# EAGLE design Schematics (EAGLE 9.6.2)
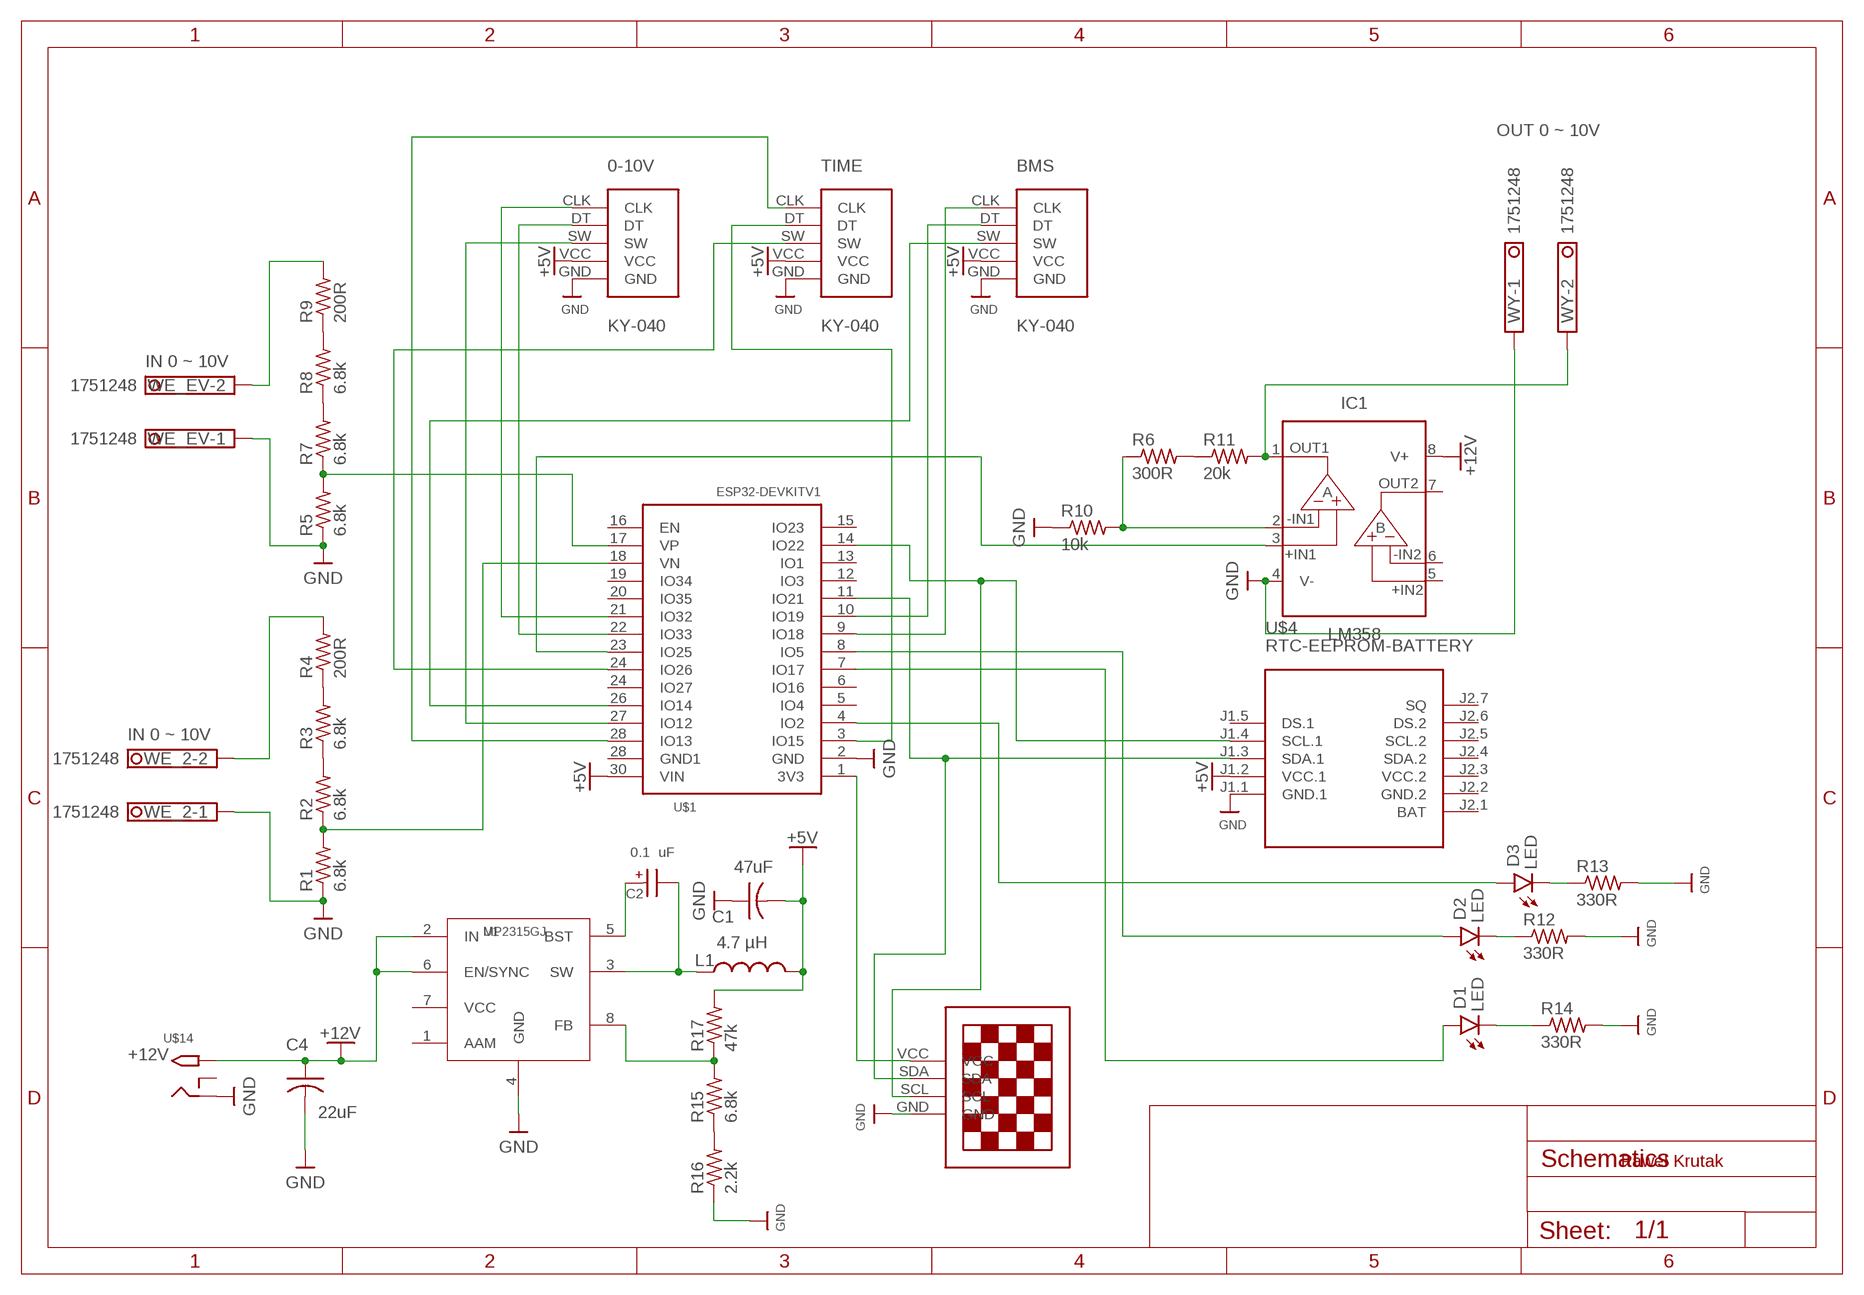
[diagram p0: schematic, sheet 1]

## Parts
0-10V  KY-040  [KY-040-PORT]
BMS  KY-040  [KY-040-PORT]
C1  47uF  ECA-1HM220  [CAP_RADIAL_2MM]
C2  0.1 uF  WCAP-ATG5_5X11_860020772001  [WCAP-ATG5_5X11(DXL)]
C4  22uF  ECA-1HM220  [CAP_RADIAL_2MM]
D1  LED  LEDWHITE90  [LEDRD254W60D565H860B_W90]
D2  LED  LEDWHITE90  [LEDRD254W60D565H860B_W90]
D3  LED  LEDWHITE90  [LEDRD254W60D565H860B_W90]
IC1  LM358  LM358_DIP  [DIP826W53P254L959H508Q8B]
L1  4.7 µH  INDUCTORSRN6045  [SRN6045]
R1  6.8k  R-US_M0805  [M0805]
R2  6.8k  R-US_M0805  [M0805]
R3  6.8k  R-US_M0805  [M0805]
R4  200R  R-US_M0805  [M0805]
R5  6.8k  R-US_M0805  [M0805]
R6  300R  R-US_M0805  [M0805]
R7  6.8k  R-US_M0805  [M0805]
R8  6.8k  R-US_M0805  [M0805]
R9  200R  R-US_M0805  [M0805]
R10  10k  R-US_M0805  [M0805]
R11  20k  R-US_M0805  [M0805]
R12  330R  R-US_M0805  [M0805]
R13  330R  R-US_M0805  [M0805]
R14  330R  R-US_M0805  [M0805]
R15  6.8k  R-US_M0805  [M0805]
R16  2.2k  R-US_M0805  [M0805]
R17  47k  R-US_M0805  [M0805]
TIME  KY-040  [KY-040-PORT]
U1  MP2315GJ  [SOT-23-8]
U$1  ESP32DEVKITV1  [ESP32-DEVKITV1]
U$4  RTC-EEPROM-BATTERY  [RTC_EEPROM_BATTERY]
U$8  13"OLED13"OLED  [1.3"OLED]
U$14  2.1MMJACKTHM  [PJ-102A]
WE_2  1751248  [1751248]
WE_EV  1751248  [1751248]
WY  1751248  [1751248]

## Nets
+5V: 0-10V.VCC BMS.VCC C1.2 L1.2 R17.2 TIME.VCC U$1.30(VIN) U$4.J1.2(VCC.1)
+12V: C4.1 IC1.8(V+) U1.2(IN) U1.6(EN/SYNC) U$14.TIP
GND: 0-10V.GND BMS.GND C1.1 C4.2 IC1.4(V-) R1.1 R5.1 R10.1 R12.2 R13.2 R14.2 R16.1 TIME.GND U1.4(GND) U$1.2(GND) U$4.J1.1(GND.1) U$8.GND U$14.RING WE_2.1 WE_EV.1 WY.1
N$1: IC1.1(OUT1) R11.2 WY.2
N$2: R6.2 R11.1
N$3: IC1.2(-IN1) R6.1 R10.2
N$4: IC1.3(+IN1) U$1.23(IO25)
N$6: R2.2 R3.1
N$7: R5.2 R7.1 U$1.17(VP)
N$8: R4.2 WE_2.2
N$9: R3.2 R4.1
N$10: R7.2 R8.1
N$11: R1.2 R2.1 U$1.18(VN)
N$12: R8.2 R9.1
N$13: U$1.1(3V3) U$8.VCC
N$14: U$1.14(IO22) U$4.J1.4(SCL.1) U$8.SCL
N$15: U$1.11(IO21) U$4.J1.3(SDA.1) U$8.SDA
N$16: 0-10V.CLK U$1.21(IO32)
N$17: BMS.CLK U$1.9(IO18)
N$18: BMS.DT U$1.10(IO19)
N$19: 0-10V.DT U$1.22(IO33)
N$20: BMS.SW U$1.26(IO14)
N$21: 0-10V.SW U$1.27(IO12)
N$22: D2.1(A) U$1.8(IO5)
N$23: R15.1 R16.2
N$24: D1.1(A) U$1.7(IO17)
N$25: R9.2 WE_EV.2
N$27: D3.2(C) R13.1
N$28: D2.2(C) R12.1
N$29: D3.1(A) U$1.4(IO2)
N$30: D1.2(C) R14.1
N$31: TIME.CLK U$1.28(IO13)
N$32: TIME.DT U$1.3(IO15)
N$33: TIME.SW U$1.24(IO26)
N$34: C2.1(+) U1.5(BST)
N$36: R15.2 R17.1 U1.8(FB)
N$37: C2.2(-) L1.1 U1.3(SW)
Unconnected: IC1.5(+IN2) IC1.6(-IN2) IC1.7(OUT2) U1.1(AAM) U1.7(VCC) U$1.5(IO4) U$1.6(IO16) U$1.12(IO3) U$1.13(IO1) U$1.15(IO23) U$1.16(EN) U$1.19(IO34) U$1.20(IO35) U$1.24(IO27) U$1.28(GND1) U$4.J1.5(DS.1) U$4.J2.1(BAT) U$4.J2.4(SDA.2) U$4.J2.5(SCL.2) U$4.J2.6(DS.2) U$4.J2.7(SQ) U$14.RING_SW

## Notes on the sheet
- OUT 0 ~ 10V
- IN 0 ~ 10V
- IN 0 ~ 10V
- +12V
- Paweł Krutak

## Power pins joined to a net without a drawn wire
GND.2: U$4.J2.2(GND.2)
VCC.2: U$4.J2.3(VCC.2)

## Library data of the parts
0-10V BMS TIME = KY-040:KY-040: Check availability <https://pricing.snapeda.com/parts/KY-040/Joy-IT/view-part?ref=eda>; AVAILABILITY: Not in stock; CHECK_PRICES: https://www.snapeda.com/parts/KY-040/Joy-IT/view-part/?ref=eda; DESCRIPTION: KY-5.0-4P Green(RAL6018/T) ; CONTACT WITH TIN PLATED MARK; MF: Joy-IT; MP: KY-040; PACKAGE: Package; PRICE: None; SNAPEDA_LINK: https://www.snapeda.com/parts/KY-040/Joy-IT/view-part/?ref=snap
C1 C4 = Resistor_Capacitor:ECA-1HM220: CAP ALUM 22UF 20% 50V RADIAL Manufacturer's datasheet <https://media.digikey.com/pdf/Data%20Sheets/Panasonic%20Electronic%20Components/ECA-xxM%20Series,TypeA.pdf>; CREATED_BY: PCBLayout.com; DIGIKEY_PART_NUMBER: P5179-ND; MANUFACTURER: Panasonic Electronic Components; MPN: ECA-1HM220; PACKAGE: CAP RADIAL 2MM LS
C2 = Wurth_Capacitors_WCAP-ATG5:WCAP-ATG5_5X11: WCAP-ATG5 Aluminium Electrolytic Capacitors General Purpose +105 °C Characteristics General purpose product series with max. operating temperature of +105 °C Mounting style: THT Radial Capacitance range: 0.1 µF ‒ 18000 µF Capacitance tolerance: ±20 % Operating temperature: -40 °C up to +105 °C for UR < 400 V(DC) -25 °C up to +105 °C for UR ≥ 400 V(DC) Endurance: 2000 h @ +105 °C Dimensions (DxL) in mm: 5.0 x 11.0 up to 22.0 x 31.0 Recommended soldering: Wave soldering Applications Filtering Smoothing Energy storage Coupling e.g. Switched-mode power supply, AC/DC converter, adapter, charger, digital camera <https://www.we-online.com/catalog/media/o683503v209%20family-wcap-atg5-860020672004.jpg> Details see: www.we-online.com/catalog/WCAP-ATG5 <www.we-online.com/catalog/WCAP-ATG5/?utm_source=eagle_model&utm_medium=description_link&utm_campaign=eisos_eagle> Updated by yingchun,Shan;2020-02-28 2020(C) Würth Elektronik; DATASHEET-URL: https://www.we-online.com/redexpert/spec/860020772001?ae; DF: 9%; DIAMETER: 5mm; I-LEAK: 3uA; I-RIPPLE: 1.3mA; L: 11mm; OPERATING-TEMPERATURE: -40 °C up to +105 °C; PART-NUMBER: 860020772001; PITCH: 2mm; TECHNICAL-REFERENCE: ATDC110R10M063DSPA3B000; VR: 63V(DC)
D1-D3 = LED Flashlight Component Library:LED: Radial LED (Round), 2.54 mm pitch, 5.65 mm body diameter, 8.60 mm body height Radial LED (Round) package with 2.54 mm pitch (lead spacing), 0.60 mm lead width, 0.50 mm lead thickness, 5.65 mm body diameter and 8.60 mm body height
IC1 = IC_Linear:LM358: Dual Operational Amplifier Reference Datasheet <https://www.ti.com/lit/ds/symlink/lm158-n.pdf>; CATEGORY: Amplifier; DESCRIPTION: Dual Operational Amplifier; MANUFACTURER: Generic; MPN: Generic; SERIES: LM358; SUB-CATEGORY: OpAmp; TYPE: Dual
L1 = BeagleBone_Blue_R3:INDUCTOR: Inductors Basic Inductor/Choke - 0603 and 1206. Footprints are not proven and vary greatly between part numbers. SRN6045- 33uH, 20% 1.4A
R1-R17 = adafruit:R-US_: RESISTOR, American symbol
U1 = MP2315GJ:MP2315GJ: MP2315 High Efficiency 3A, 24V, 500kHz Synchronous Step Down Converter; MPN: MP2315
U$1 = ESP32-DEVKITV1:ESP32DEVKITV1; OC_FARNELL: unknown
U$4 = diy-modules:RTC-EEPROM-BATTERY: RTC Module with Battery and EEPROM based on DS1307 and AT24C32 chips
U$8 = 13oled:13"OLED
U$14 = adafruit:2.1MMJACK: 2.1mm x 5.5mm THM DC jack with internal switch. Digikey part #PJ-102A, 4UCON part #05537 2.1mm x 5.5mm SMT DC jack with internal switch. Digikey part #PJ-002A-SMT, 4UCON part #03267 By microbuilder.eu & adafruit.com
WE_2 WE_EV WY = con-phoenix-350:1751248: MKDS 1/ 2-3,5 Printklemme Nennstrom: 10 A Bemessungsspannung: 160 V Raster: 3,5 mm Polzahl: 2 Montageart: Löten Anschlussart: Schraubanschluss Anschlussrichtung vom Leiter zur Platine: 0° Source: http://eshop.phoenixcontact.com .. 1751248.pdf; OC_FARNELL: unknown; OC_NEWARK: unknown

## Net classes
0 default: width 0.381 mm, drill 0.351 mm, clearance 0.381 mm

## Board
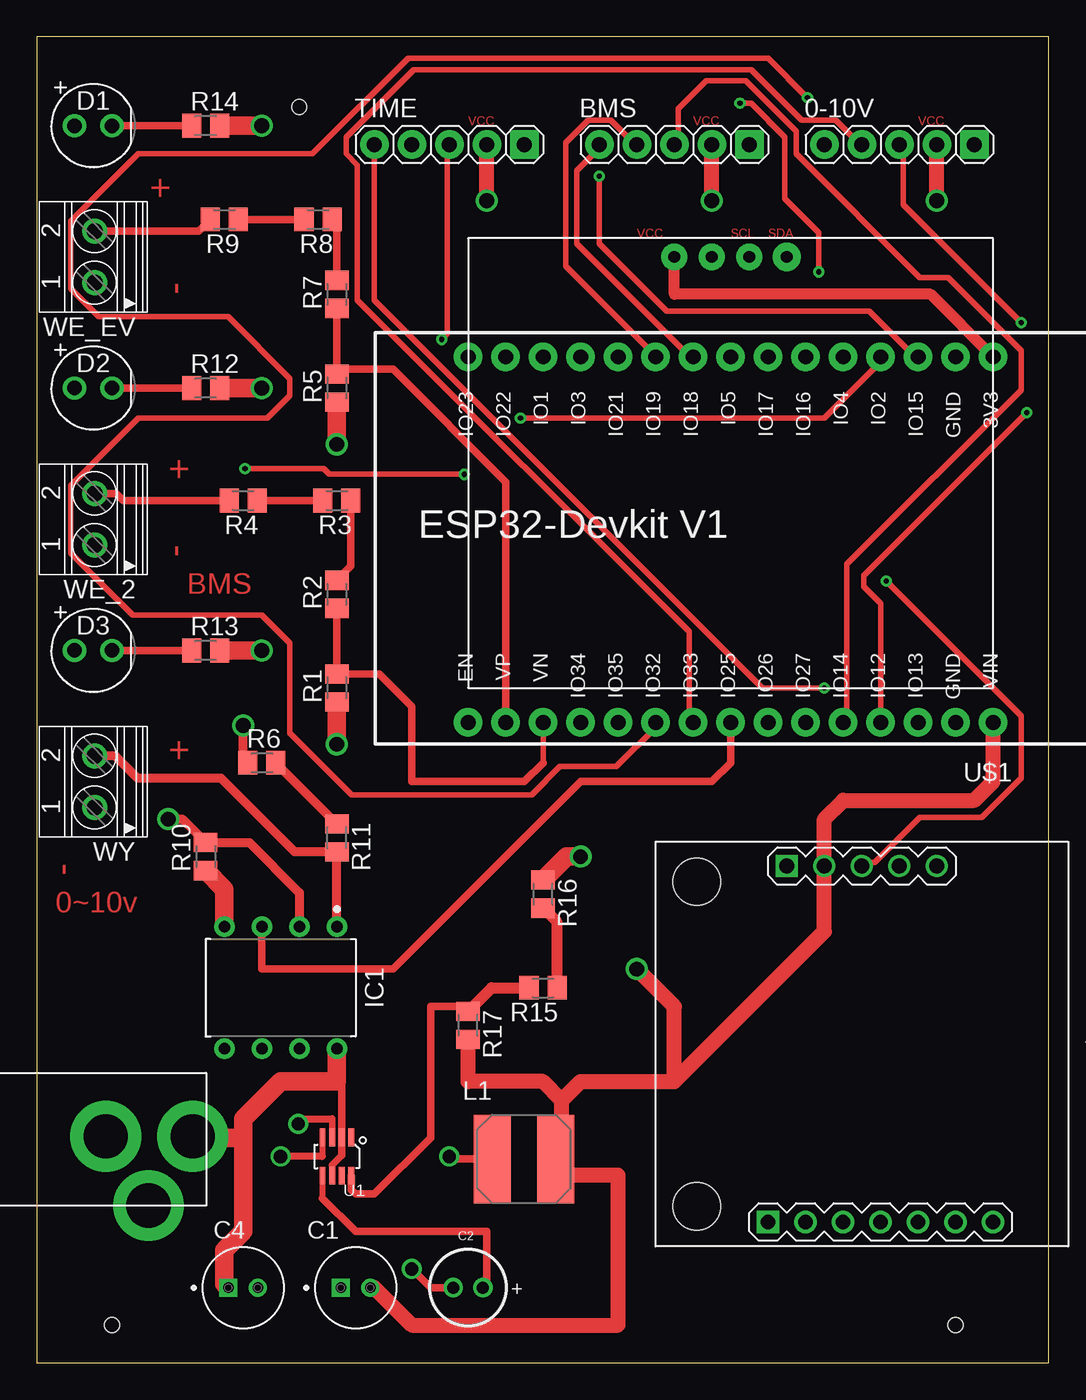
[diagram p1: board, top side]
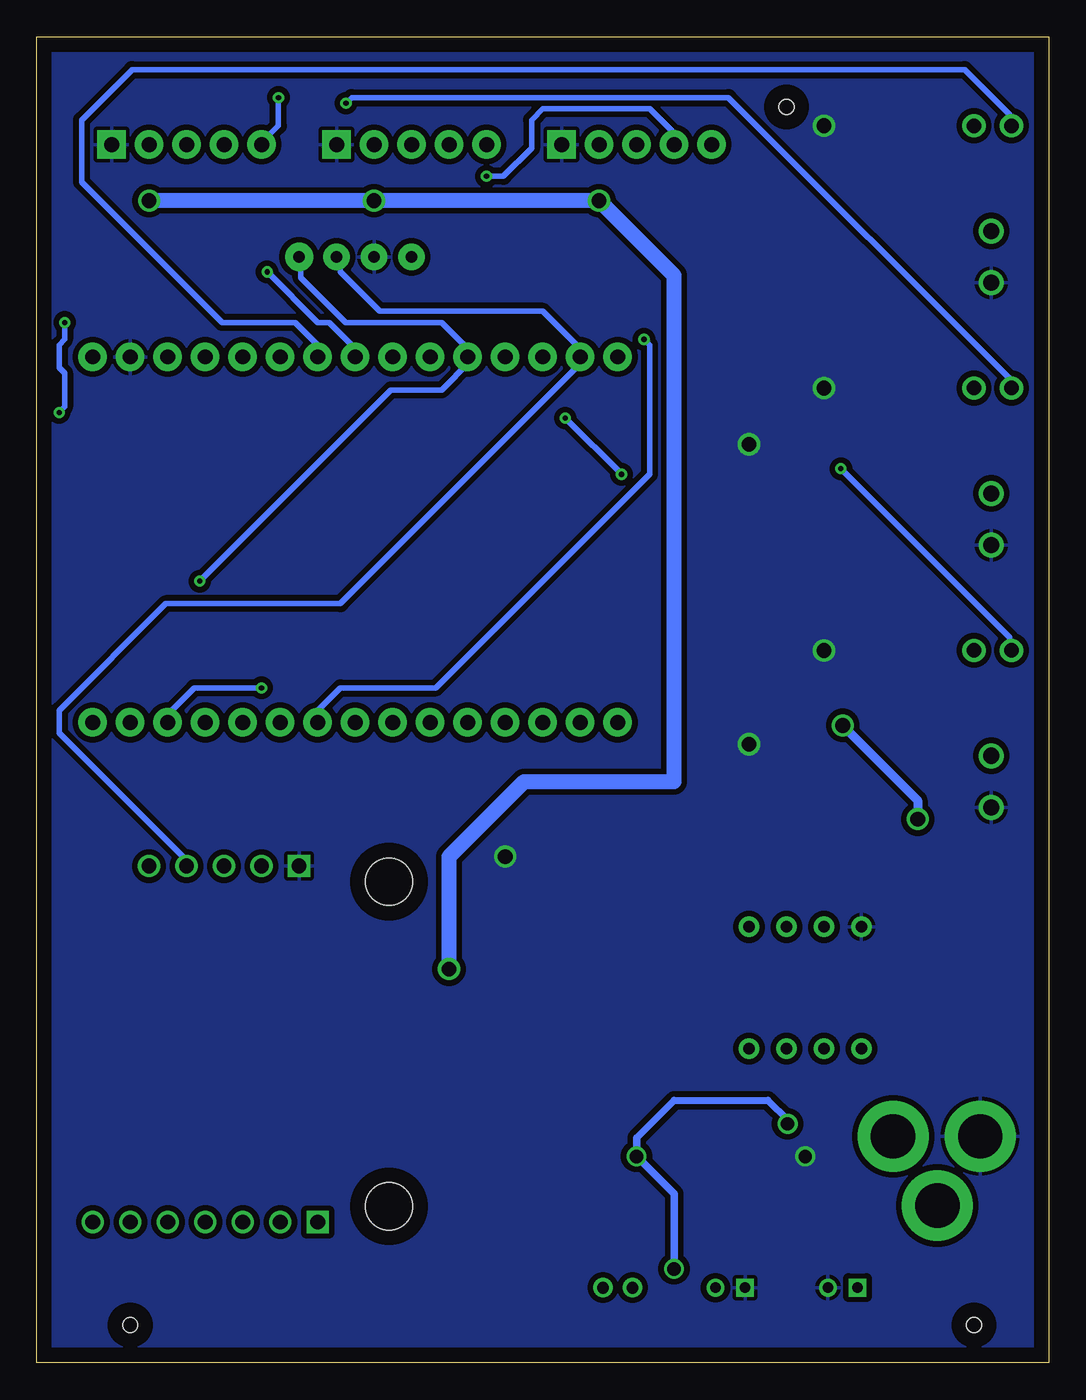
[diagram p2: board, bottom side, seen from below]

Size 68.56 x 89.84 mm. Coordinates in mm from the lower left corner, seen from the top.
Outline: 0,0 68.56,0 68.56,89.84 0,89.84 0,0
Copper layers (1*16): Top 0.035mm / dielectric 1.5mm / Bottom 0.035mm
Design rules "default *": minimum track width 6mil, minimum drill 0.35mm, track to track 15mil, track to pad 10mil, pad to pad 10mil, via to via 30mil, smd to smd 6mil, copper to edge 40mil, drill to drill 6mil, minimum pad ring 10mil, minimum via ring 8mil, stop-mask expansion 4mil, vias tented up to drill 0mil, thermal gap 10mil
Holes 1 mm at 5.08,2.54 62.23,2.54 17.78,85.09

### Footprints (pad centres in the part's own frame; a part is rotated, then mirrored left to right if it is on the bottom)
KY-040-PORT = drill 1.016 pad 1.93: CLK -6.35,0; DT -3.81,0; SW -1.27,0; VCC 1.27,0 | drill 1.016 pad 1.93 square: GND 3.81,0
CAP_RADIAL_2MM = drill 0.7 pad 1.1 square: 1 -1,0 | drill 0.7 pad 1.1: 2 1,0
WCAP-ATG5_5X11(DXL) = drill 0.8: 1 1,0; 2 -1,0
LEDRD254W60D565H860B_W90 = drill 0.981 pad 1.581: 1 -1.27,0; 2 1.27,0
DIP826W53P254L959H508Q8B = drill 0.786 pad 1.386: 1 -4.13,3.81; 2 -4.13,1.27; 3 -4.13,-1.27; 4 -4.13,-3.81; 5 4.13,-3.81; 6 4.13,-1.27; 7 4.13,1.27; 8 4.13,3.81
SRN6045 = smd 2.5 x 6: 1 -2.175,-0.175; 2 2.125,-0.175
M0805 = smd 1.3 x 1.6: 1 -0.95,0; 2 0.95,0
SOT-23-8 = smd 0.4 x 1.2: 1 -0.975,-1.3; 2 -0.325,-1.3; 3 0.325,-1.3; 4 0.975,-1.3; 5 0.975,1.3; 6 0.325,1.3; 7 -0.325,1.3; 8 -0.975,1.3
ESP32-DEVKITV1 = drill 1 pad 1.93: 1 -22.87,-13.54; 2 -20.33,-13.54; 3 -17.79,-13.54; 4 -15.25,-13.54; 5 -12.71,-13.54; 6 -10.17,-13.54; 7 -7.63,-13.54; 8 -5.09,-13.54; 9 -2.55,-13.54; 10 -0.01,-13.54; 11 2.53,-13.54; 12 5.07,-13.54; 13 7.61,-13.54; 14 10.15,-13.54; 15 12.69,-13.54; 16 12.69,11.23; 17 10.15,11.23; 18 7.61,11.23; 19 5.07,11.23; 20 2.53,11.23; 21 -0.01,11.23; 22 -2.55,11.23; 23 -5.09,11.23; 24 -7.63,11.23; 25 -10.17,11.23; 26 -12.71,11.23; 27 -15.25,11.23; 28 -17.79,11.23; 29 -20.33,11.23; 30 -22.87,11.23
RTC_EEPROM_BATTERY = drill 1 square: J1.1 -12.065,-5.08; J2.1 12.065,-6.35 | drill 1: J1.2 -12.065,-2.54; J1.3 -12.065,0; J1.4 -12.065,2.54; J1.5 -12.065,5.08; J2.2 12.065,-3.81; J2.3 12.065,-1.27; J2.4 12.065,1.27; J2.5 12.065,3.81; J2.6 12.065,6.35; J2.7 12.065,8.89 | hole 3.2: -11,-11.176; 11,-11.176
1.3"OLED = drill 0.8 pad 1.778: GND 2.54,0; SCL 5.08,0; VCC 0,0 | drill 0.8 pad 1.9: SDA 7.62,0
PJ-102A = drill 3 pad 4.8: RING 0.1,-3.39; RING_SW -4.6,-6.29; TIP 0.1,-9.29
1751248 = drill 1.1 pad 1.7: 1 -1.75,-0.1; 2 1.75,-0.1

### Placement (x,y rotation side)
0-10V  59.69,82.55 0 top
BMS  44.45,82.55 0 top
C1  21.59,5.08 0 top
C2  29.21,5.08 0 top
C4  13.97,5.08 0 top
D1  3.81,83.82 0 top
D2  3.81,66.04 0 top
D3  3.81,48.26 0 top
IC1  16.51,25.4 270 top
L1  33.02,13.97 0 top
R1  20.32,45.72 90 top
R2  20.32,52.07 90 top
R3  20.32,58.42 180 top
R4  13.97,58.42 180 top
R5  20.32,66.04 90 top
R6  15.24,40.64 0 top
R7  20.32,72.39 90 top
R8  19.05,77.47 180 top
R9  12.7,77.47 180 top
R10  11.43,34.29 90 top
R11  20.32,35.56 270 top
R12  11.43,66.04 0 top
R13  11.43,48.26 0 top
R14  11.43,83.82 0 top
R15  34.29,25.4 180 top
R16  34.29,31.75 270 top
R17  29.21,22.86 270 top
TIME  29.21,82.55 0 top
U1  20.32,13.97 180 top
U$1  41.91,54.61 180 top
U$4  55.88,21.59 270 top
U$8  43.18,74.93 0 top
U$14  1.27,15.24 90 top
WE_2  3.81,57.15 90 top
WE_EV  3.81,74.93 90 top
WY  3.81,39.37 90 top

### Tracks (layer width: path | path; a pad name or v marks a point on that pad's centre or on a via)
+5V  (via drill 1)
  Top 0.381: U$1.30 64.77,43.43 64.77,43.18 | L1.2 35.05,13.34 35.43,12.95 35.56,12.7
  Top 1.016: C1.2 22.86,5.08 25.4,2.54 39.37,2.54 39.37,12.7 35.56,12.7 | R17.2 29.21,19.05 34.29,19.05 35.56,17.78 | 43.18,19.05 53.34,29.21 U$4.J1.2 53.34,36.83 54.61,38.1 63.5,38.1 64.77,39.37 64.77,43.18 | 43.18,19.05 43.18,24.13 v40.64,26.67 | v30.48,78.74 TIME.VCC | v45.72,78.74 BMS.VCC | v60.96,78.74 0-10V.VCC | L1.2 35.56,14.21 35.56,17.78 | 35.56,17.78 36.83,19.05 43.18,19.05
  Bottom 1.016: v40.64,26.67 40.64,34.29 35.56,39.37 25.4,39.37 25.4,73.66 v30.48,78.74 v45.72,78.74 v60.96,78.74
+12V
  Top 0.406: U1.6 20,13.39
  Top 0.483: 20.64,14.04 20,13.39
  Top 0.508: 20.64,14.04 U1.2 20.64,18.73 20.32,19.05
  Top 1.27: U$14.TIP 10.66,15.24 13.97,15.24 | 13.97,15.24 13.97,8.89 12.7,7.62 12.7,5.35 C4.1 | 13.97,15.24 13.97,16.51 16.51,19.05 20.32,19.05 IC1.8
GND  (via drill 0.9, 1)
  Top 0.406: U1.4 19.34,14
  Top 0.483: 19.34,14 19.32,13.97 v16.51,13.97
  Top 1.27: R5.1 v20.32,62.23 | R14.2 v15.24,83.82 | R10.1 12.7,32.07 IC1.4 | R1.1 v20.32,41.91 | R12.2 v15.24,66.04 | R13.2 v15.24,48.26 | v36.83,34.29 35.88,34.29 R16.1
  pour Bottom: 0,0 68.58,0 68.58,90.17 0,90.17
N$1
  Top 0.61: IC1.1 R11.2 17.46,34.61 12.48,39.59 6.84,39.59 5.31,41.12 WY.2
N$2
  Top 0.61: R11.1 R6.2
N$3  (via drill 1)
  Top 0.61: IC1.2 17.78,31.84 14.38,35.24 R10.2 9.84,36.83 v8.89,36.83 | R6.1 13.97,40.96 v13.97,43.18
  Bottom 0.61: v13.97,43.18 8.89,38.1 v8.89,36.83
N$4
  Top 0.508: IC1.3 15.24,26.67 24.13,26.67 36.83,39.37 45.72,39.37 47,40.65 U$1.23
N$6
  Top 0.508: R3.1 21.27,53.97 R2.2
N$7
  Top 0.508: R7.1 R5.2 20.64,67.31 24.13,67.31 31.76,59.68 U$1.17
N$8
  Top 0.508: R4.2 5.86,58.42 5.38,58.9 WE_2.2
N$9
  Top 0.508: R4.1 R3.2
N$10
  Top 0.508: R8.1 20.32,77.15 R7.2
N$11
  Top 0.381: 34.29,40.64 34.3,40.65 U$1.18
  Top 0.508: R2.1 R1.2 23.18,46.67 25.4,44.45 25.4,39.37 33.02,39.37 34.29,40.64
N$12
  Top 0.508: R9.1 R8.2
N$13
  Top 0.762: U$1.1 60.54,72.39 43.18,72.39 U$8.VCC
N$14
  Bottom 0.381: U$4.J1.4 58.67,33.91 58.67,34.29 67.06,42.67 67.06,44.2 59.82,51.44 48.01,51.44 31.62,67.82 U$1.14 32,68.2 32,68.96 34.29,71.25 45.34,71.25 48.01,73.91 48.01,74.68 U$8.SCL
N$15  (via drill 0.35)
  Top 0.381: v57.53,52.96 66.67,43.81 66.67,39.62 64.01,36.96 59.82,36.96 56.77,33.91 56.01,33.91 U$4.J1.3
  Bottom 0.381: v57.53,52.96 44.58,65.91 41.15,65.91 39.24,67.82 U$1.11 39.62,68.2 39.62,68.96 41.15,70.48 47.62,70.48 50.67,73.53 50.67,74.68 U$8.SDA
N$16  (via drill 0.35)
  Top 0.381: v52.2,85.72 49.53,88.39 25.15,88.39 18.67,81.92 6.86,81.92 2.29,77.34 2.29,72.77 4.19,70.87 12.95,70.87 17.14,66.67 17.14,65.53 15.62,64.01 6.86,64.01 2.29,59.44 2.29,54.86 6.48,50.67 15.24,50.67 17.14,48.77 17.14,42.67 21.34,38.48 33.53,38.48 35.43,40.39 39.24,40.39 41.91,43.05 U$1.21
  Bottom 0.381: v52.2,85.72 52.2,83.82 53.34,82.68 0-10V.CLK
N$17
  Top 0.381: BMS.CLK 38.1,82.3 36.58,80.77 36.58,75.82 44.2,68.2 U$1.9
N$18
  Top 0.381: BMS.DT 40.39,82.68 38.86,84.2 37.34,84.2 35.81,82.68 35.81,74.3 41.91,68.2 U$1.10
N$19
  Top 0.381: U$1.22 44.2,43.43 44.2,49.53 21.72,72.01 21.72,81.15 20.95,81.92 20.95,83.06 25.53,87.63 48.39,87.63 51.82,84.2 54.1,84.2 55.63,82.68 0-10V.DT
N$20
  Top 0.381: BMS.SW 43.43,82.68 43.43,84.96 45.34,86.87 48.01,86.87 51.44,83.44 51.44,81.92 59.82,73.53 61.72,73.53 66.67,68.58 66.67,65.91 54.86,54.1 54.86,43.43 U$1.26
N$21  (via drill 0.35)
  Top 0.381: v67.06,64.39 56.01,53.34 56.01,52.58 57.15,51.44 57.15,43.43 U$1.27 | v66.67,70.48 58.67,78.49 58.67,82.3 0-10V.SW
  Bottom 0.381: v67.06,64.39 66.67,64.77 66.67,67.06 67.06,67.44 67.06,68.96 66.67,69.34 v66.67,70.48
N$22  (via drill 0.35)
  Top 0.381: v47.62,85.34 48.39,85.34 50.67,83.06 50.67,78.87 52.96,76.58 v52.96,73.91
  Bottom 0.381: v47.62,85.34 47.24,85.72 21.72,85.72 2.67,66.67 2.67,66.29 D2.1 | v52.96,73.91 49.53,70.48 48.77,70.48 47.24,68.96 47.24,68.2 U$1.8
N$23
  Top 0.762: R15.1 35.24,29.85 R16.2
N$24
  Bottom 0.381: D1.1 2.67,83.82 2.67,84.58 5.71,87.63 62.1,87.63 65.53,84.2 65.53,80.01 56.01,70.48 51.05,70.48 49.53,68.96 49.53,68.2 U$1.7
N$25
  Top 0.508: WE_EV.2 10.96,76.68 R9.2
N$27
  Top 0.508: D3.2 R13.1
N$28
  Top 0.508: D2.2 R12.1
N$29  (via drill 0.35)
  Top 0.381: v14.1,60.58 19.43,60.58 19.81,60.2 v28.96,60.2 | v32.77,64.01 53.34,64.01 57.15,67.82 U$1.4
  Bottom 0.381: v14.1,60.58 2.67,49.15 2.67,48.39 D3.1 | v32.77,64.01 v28.96,60.2
N$30
  Top 0.508: D1.2 R14.1
N$31  (via drill 0.35)
  Top 0.381: v53.34,45.72 49.15,45.72 22.86,72.01 TIME.CLK
  Bottom 0.381: v53.34,45.72 57.91,45.72 59.44,44.2 59.44,43.43 U$1.28
N$32  (via drill 0.35)
  Top 0.381: v38.1,80.39 38.1,75.82 42.67,71.25 56.39,71.25 59.44,68.2 U$1.3
  Bottom 0.381: v38.1,80.39 36.96,80.39 35.05,82.3 35.05,84.2 34.29,84.96 27.05,84.96 25.53,83.44 25.53,82.68 TIME.DT
N$33  (via drill 0.35)
  Top 0.381: v27.43,69.34 27.81,69.72 27.81,82.3 TIME.SW
  Bottom 0.381: v27.43,69.34 27.05,68.96 27.05,60.2 41.53,45.72 48.01,45.72 49.53,44.2 49.53,43.43 U$1.24
N$34
  Top 0.406: U1.5 19.34,11.13
  Top 0.508: C2.1 30.48,5.35 30.48,8.89 21.59,8.89 19.34,11.13
N$36
  Top 0.508: U1.8 21.3,11.72 21.59,11.43 22.86,11.43 26.67,15.24 26.67,24.13 28.89,24.13 R17.1
  Top 0.762: R17.1 30.8,25.4 R15.2
N$37  (via drill 0.9)
  Top 0.457: U1.3 20,16.54 19.96,16.51
  Top 0.483: v17.71,16.18 18.04,16.51 19.96,16.51
  Top 0.508: C2.2 26.67,5.08 v25.4,6.35 | L1.1 28.11,13.79 v27.94,13.97
  Bottom 0.483: 27.94,15.24 25.4,17.78 19.05,17.78 17.71,16.44 v17.71,16.18
  Bottom 0.508: 27.94,15.24 v27.94,13.97 25.4,11.43 v25.4,6.35

### Text on the board
Top: VCC | VCC | VCC | + | VCC | SCL | SDA | - | + | - | BMS | + | - | 0~10v